# Altium project PCB_Project.PrjPcb
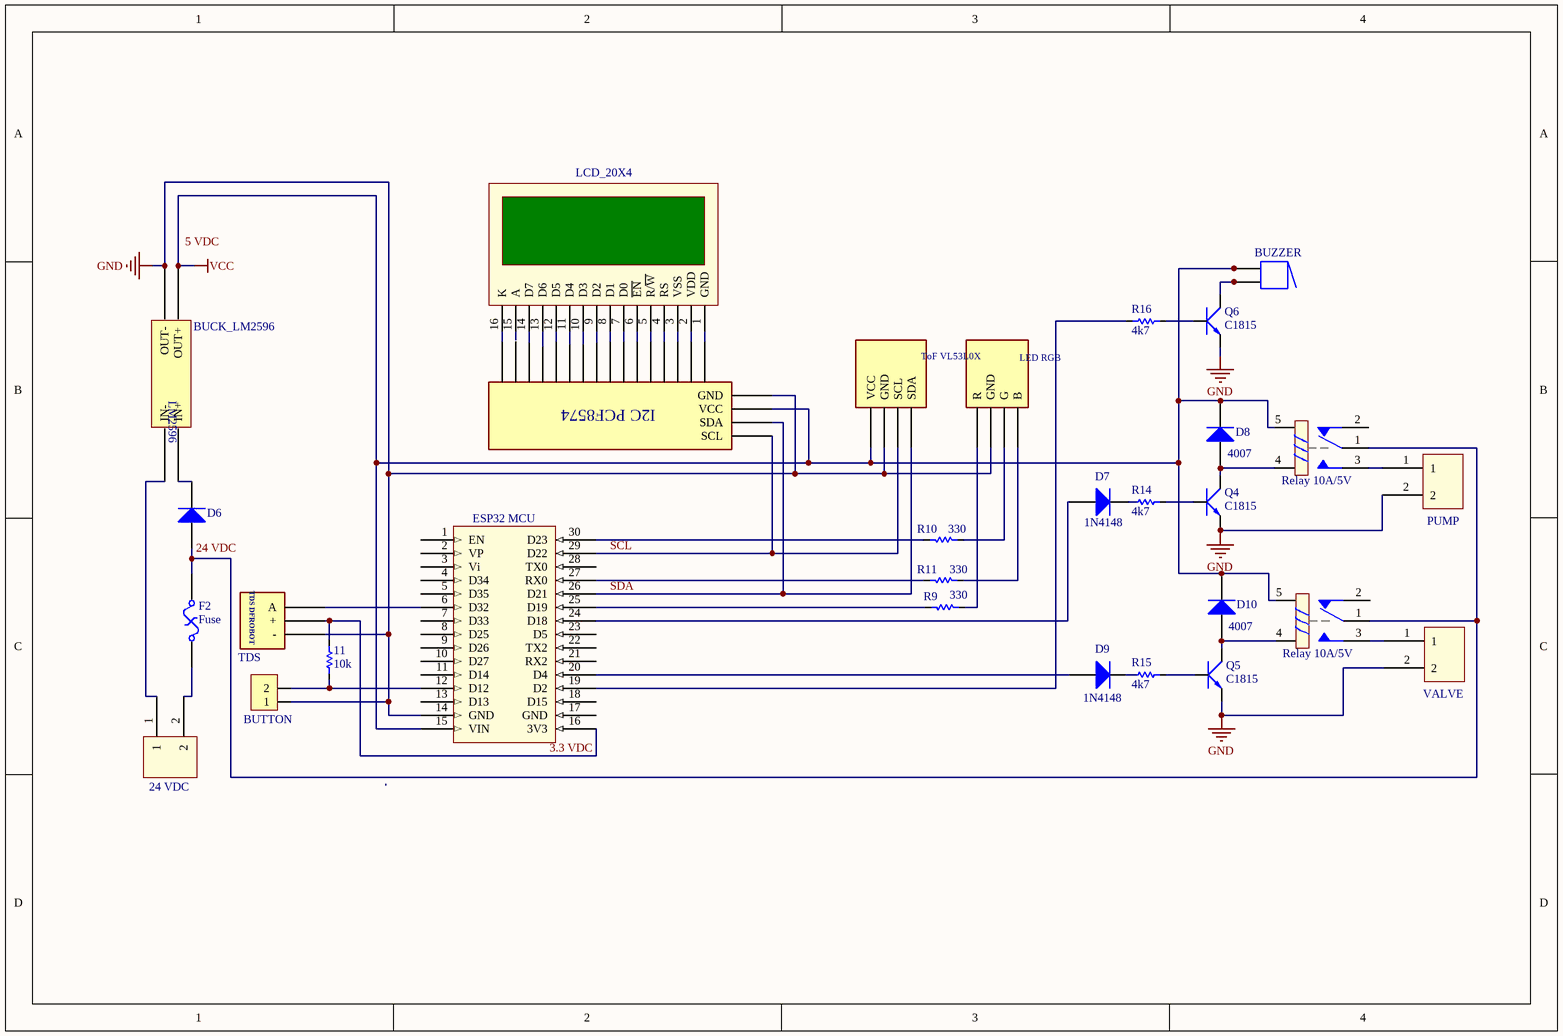
[diagram p0: Wired.SchDoc]
1 sheet, 30 parts. Net scope: global (net labels, ports and power ports of the same name join across sheets).
Board file: PCB2.PcbDoc

## Sheet Wired.SchDoc
size A4; PageSetup: Record=PageOptions|CenterHorizontal=True|CenterVertical=True|PrintScale=1.00|XCorrection=1.00|YCorrection=1.00|PrintKind=1|BorderSize=5000000|LeftOffset=0|BottomOffset=0|Orientation=2|PaperLength=1000|PaperWidth=1000|Scale=100|PaperSource=7|PrintQuality=-3|MediaType=1|DitherType=10|PrintScaleMode=0|PaperKind=A4|PaperIndex=9

### Parts
(Parts that share a designator on the sheet are numbered #1, #2 ... from top to bottom, then left to right.)
11  10k  [RES-1/4W]
13  BUTTON  [HDR2]
*#1  LED RGB  (value not drawn)
*#2  ToF VL53L0X  (value not drawn)
*#3  TDS
?  I2C_PCF8574  (value not drawn)
BUZZER  (no value)  [ABSM-1574]
CN4  24 VDC  [HB9500]
CN5  PUMP  [HB9500]
CN6  VALVE  [HB9500]
D6  SR5200-5A  [DO-201AD]  (value not drawn)
D7  1N4148  [DO-41]
D8  4007  [DO-41]
D9  1N4148  [DO-41]
D10  4007  [DO-41]
F2  Fuse  [PIN-W2/E2.8]
L2  BUCK_LM2596  [BUCK_LM2596]
LCD_20X4  (no value)  [LCD20X4A]
Q4  C1815  [TO92-123]
Q5  C1815  [TO92-123]
Q6  C1815  [TO92-123]
R9  330  [RES-1/4W]
R10  330  [RES-1/4W]
R11  330  [RES-1/4W]
R14  4k7  [RES-1/4W]
R15  4k7  [RES-1/4W]
R16  4k7  [RES-1/4W]
RL3  Relay 10A/5V  [RELAY SMALL]
RL4  Relay 10A/5V  [RELAY SMALL]
U5  ESP32 MCU  [Model Name]

### Nets
GND: 13.1 *#1.3(GND) *#2.3(GND) *#3.SCL(-) ?.3(GND) CN5.2 CN6.2 L2.3(OUT-) Q4.1(E) Q5.1(E) Q6.1(E) U5.14(GND)
VCC: *#2.2(VCC) ?.2(VCC) BUZZER.1 BUZZER.1A D8.2(K) D10.2(K) L2.4(OUT+) RL3.5 RL4.5 U5.15(VIN)
3.3 VDC: 11.1 *#3.3(+) U5.16(3V3)
SCL: *#2.SCL ?.SCL U5.29(D22)
SDA: *#2.1(SDA) ?.1(SDA) U5.26(D21)
Net11_2: 11.2 13.2 U5.12(D12)
Net*#1_1: *#1.1(B) R11.1
Net*#1_2: *#1.2(R) R9.1
Net*#1_SCL: *#1.SCL(G) R10.1
Net*#3_2: *#3.2(A) U5.6(D32)
NetBUZZER_2: BUZZER.2 BUZZER.2A Q6.2(C)
NetCN4_1: CN4.1 L2.2(IN-)
NetCN4_2: CN4.2 F2.1
NetCN5_1: CN5.1 RL3.3
NetCN6_1: CN6.1 RL4.3
NetD6_1: D6.1(A) F2.2 RL3.1 RL4.1
NetD6_2: D6.2(K) L2.1(IN+)
NetD7_1: D7.1(A) U5.24(D18)
NetD8_1: D8.1(A) Q4.2(C) RL3.4
NetD9_1: D9.1(A) U5.20(D4)
NetD9_2: D9.2(K) R15.1
NetD10_1: D10.1(A) Q5.2(C) RL4.4
NetQ4_3: Q4.3(B) R14.2
NetQ5_3: Q5.3(B) R15.2
NetQ6_3: Q6.3(B) R16.1
NetR9_2: R9.2 U5.25(D19)
NetR10_2: R10.2 U5.30(D23)
NetR11_2: R11.2 U5.27(RX0)
NetR16_2: R16.2 U5.19(D2)

Not connected (* = marked no-connect by the designer): ? ?1 ?2 ?3 ?4 ?5 ?6 ?7 ?8 ?9 ?10 ?11 ?12 ?13 ?14 ?15 ?16; D7 2(K); LCD_20X4 1(GND) 2(VDD) 3(VSS) 4(RS) 5(R/~{W}) 6(~{EN}) 7(D0) 8(D1) 9(D2) 10(D3) 11(D4) 12(D5) 13(D6) 14(D7) 15(A) 16(K); R14 1; RL3 2; RL4 2; U5 1(EN) 2(VP) 3(Vi) 4(D34) 5(D35) 7(D33) 8(D25) 9(D26) 10(D27) 11(D14) 13(D13) 17(GND) 18(D15) 21(RX2) 22(TX2) 23(D5) 28(TX0)

### Notes on the sheet
- Labels drawn without touching a wire or pin: 5 VDC, 24 VDC
- (in symbol BUCK_LM2596) LM2596
- (in symbol I2C_PCF8574) I2C PCF8574
- (in symbol TDS) TDS DFROBOT

### Library data of the parts
11 R9-R11 R14-R16 = Res: Manufacturer: Generic Components; Class: Passive; SubClass: R; Published: 08/06/2000; Publisher: Altium Hobart Technology Centre
13 = Header2: Header IDC, 2 x 1 Pin Vertical 2.54mm Pitch (Non-Boxed, Male); Manufacturer: W¨¹rth Elektronik eiSos GmbH; partNo: 613002143121; ComponentLink1 Description: Manufacturer; ComponentLink2 Description: Datasheet; NoPins: 02; Created Date: 29 March 2013; ComponentLink1URL: http://www.we-online.com; ComponentLink2URL: http://katalog.we-online.de/em/datasheet/6130xx143121.pdf; Created by: Karrer Zheng
BUZZER = Buzzer: Magnetic Transducer Buzzer; Published: 24-Mar-1999; LatestRevisionDate: 17-Dec-2003; LatestRevisionNote: Schematic revised, PCB Footprint replaced.; DatasheetVersion: 17-Dec-2003; PackageReference: ABSM-1574; Publisher: Altium Limited; PackageDescription: Magnetic Transducer Buzzer; ComponentLink1Description: Manufacturer Link; ComponentLink1URL: http://www.megastar.com/linecard/buzzmode/index.php
CN4-CN6 = Domino2
D6 = Diode 1N5408: 3 Amp Medium Power Silicon Rectifier Diode; Published: 8-Jun-2000; LatestRevisionDate: 17-Jul-2002; LatestRevisionNote: Re-released for DXP Platform.; DatasheetVersion: Aug-1984; PackageReference: DO-201AD; Publisher: Altium Limited; PackageDescription: Diode, Axial; Body 9.5 x 5.3 mm (LxDia. max), Lead Dia. 1.32 mm (max); ComponentLink1Description: Manufacturer Link; ComponentLink1URL: http://www.irf.com/
D7-D10 = Diode 1N4007: 1 Amp General Purpose Rectifier; Published: 8-Jun-2000; LatestRevisionDate: 17-Jul-2002; LatestRevisionNote: Re-released for DXP Platform.; DatasheetVersion: 1998; PackageVersion: Aug-1999; PackageReference: DO-41; Publisher: Altium Limited; PackageDescription: Diode, Axial; Body 5.2 x 2.7 mm (LxDia. max), Lead Dia. 0.86 mm (max); Code_JEDEC: DO-204-AL; ComponentLink1Description: Manufacturer Link; ComponentLink1URL: http://www.fairchildsemi.com/; ComponentLink2Description: Datasheet; ComponentLink2URL: http://www.fairchildsemi.com/ds/1N%2F1N4001.pdf
F2 = Fuse Thermal: Thermal Fuse; Published: 24-Mar-1999; LatestRevisionDate: 17-Jul-2002; LatestRevisionNote: Re-released for DXP Platform.; PackageReference: PIN-W2/E2.8; Publisher: Altium Limited; PackageDescription: Thru-Hole; 2 Leads
LCD_20X4 = LCD20x4A: LCD dipslay 20 char, 4 line; Value: Jum 40; Value: LCD 20x4A
Q4-Q6 = C1815: NPN 600mW, ECB; Value: C1815
RL3 RL4 = Relay 5: Relay SPDT,10A - 12VDC 5 Pin; Value: Relay SPDT, 10A, 12V
U5 = ESP8266 MCU